# Altium schematic sheet Nand8Bit.SchDoc
size A
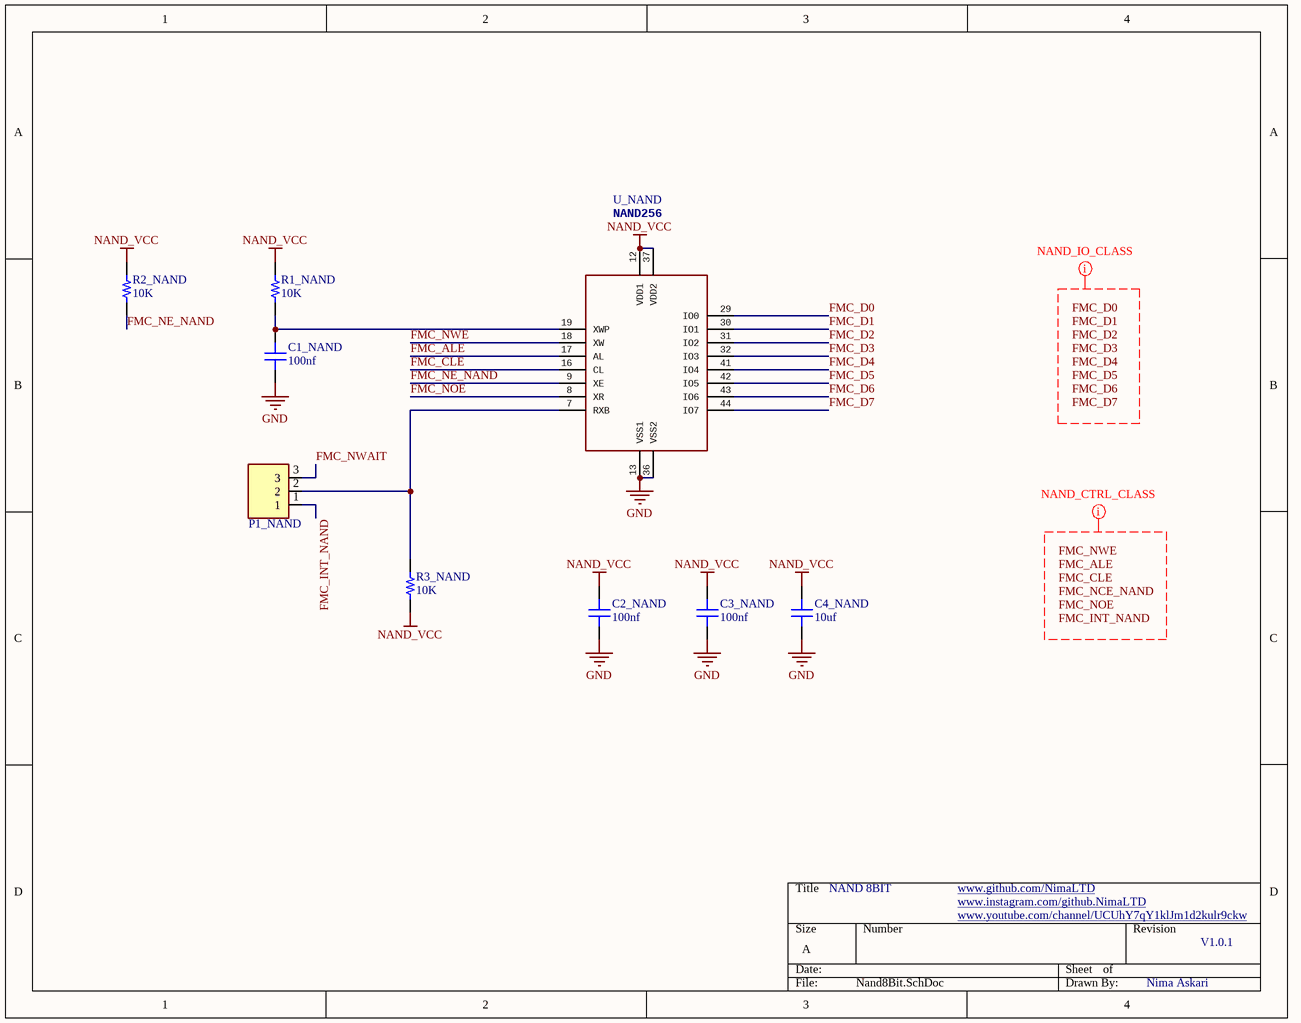
[diagram p0: Nand8Bit.SchDoc]

## Parts
C1_NAND  100nf  [CAP 0805]
C2_NAND  100nf  [CAP 0805]
C3_NAND  100nf  [CAP 0805]
C4_NAND  10uf  [CAP 0805]
P1_NAND  CONN_PWL_3  [SOLDER 3Pin SELECTOR]  (value not drawn)
R1_NAND  10K  [RES 0805]
R2_NAND  10K  [RES 0805]
R3_NAND  10K  [RES 0805]
U_NAND  NAND256  [TSOP48]

## Nets
GND: C1_NAND.1 C2_NAND.1 C3_NAND.1 C4_NAND.1 U_NAND.13(VSS1) U_NAND.36(VSS2)
NAND_VCC: C2_NAND.2 C3_NAND.2 C4_NAND.2 R1_NAND.2 R2_NAND.2 R3_NAND.2 U_NAND.12(VDD1) U_NAND.37(VDD2)
FMC_ALE: U_NAND.17(AL)
FMC_CLE: U_NAND.16(CL)
FMC_D0: U_NAND.29(IO0)
FMC_D1: U_NAND.30(IO1)
FMC_D2: U_NAND.31(IO2)
FMC_D3: U_NAND.32(IO3)
FMC_D4: U_NAND.41(IO4)
FMC_D5: U_NAND.42(IO5)
FMC_D6: U_NAND.43(IO6)
FMC_D7: U_NAND.44(IO7)
FMC_INT_NAND: P1_NAND.1
FMC_NE_NAND: R2_NAND.1 U_NAND.9(XE)
FMC_NOE: U_NAND.8(XR)
FMC_NWAIT: P1_NAND.3
FMC_NWE: U_NAND.18(XW)
NetC1_NAND_2: C1_NAND.2 R1_NAND.1 U_NAND.19(XWP)
NetP1_NAND_2: P1_NAND.2 R3_NAND.1 U_NAND.7(RXB)

## Layout directives
net class NAND_IO_CLASS; rule Matched Net Lengths [Tolerance = 0.2mm]: FMC_D0, FMC_D1, FMC_D2, FMC_D3, FMC_D4, FMC_D5, FMC_D6, FMC_D7
net class NAND_CTRL_CLASS; rule Matched Net Lengths [Tolerance = 0.2mm]: FMC_ALE, FMC_CLE, FMC_INT_NAND, FMC_NCE_NAND, FMC_NOE, FMC_NWE

## Notes on the sheet
- NAND 8BIT
- www.github.com/NimaLTD <http://www.github.com/NimaLTD>
- www.instagram.com/github.NimaLTD <http://www.instagram.com/github.NimaLTD>
- www.youtube.com/channel/UCUhY7qY1klJm1d2kulr9ckw <http://www.youtube.com/channel/UCUhY7qY1klJm1d2kulr9ckw>
- V1.0.1
- Nima Askari
- Labels drawn without touching a wire or pin: FMC_ALE, FMC_CLE, FMC_D0, FMC_D1, FMC_D2, FMC_D3, FMC_D4, FMC_D5, FMC_D6, FMC_D7, FMC_INT_NAND, FMC_NCE_NAND, FMC_NOE, FMC_NWE

## Library data of the parts
C1_NAND C2_NAND C3_NAND C4_NAND = Cap SMD 0805: SMT Capacitor
  C1_NAND C2_NAND C3_NAND: Value: 100nf
  C4_NAND: Value: 10uf
P1_NAND = Solder 3Pin Selector: VALUE: CONN_PWL_3
R1_NAND R2_NAND R3_NAND = Res SMD 0805: SMD Resistor; Value: 10K